# EAGLE design bvsys1 (EAGLE 9.1.0)
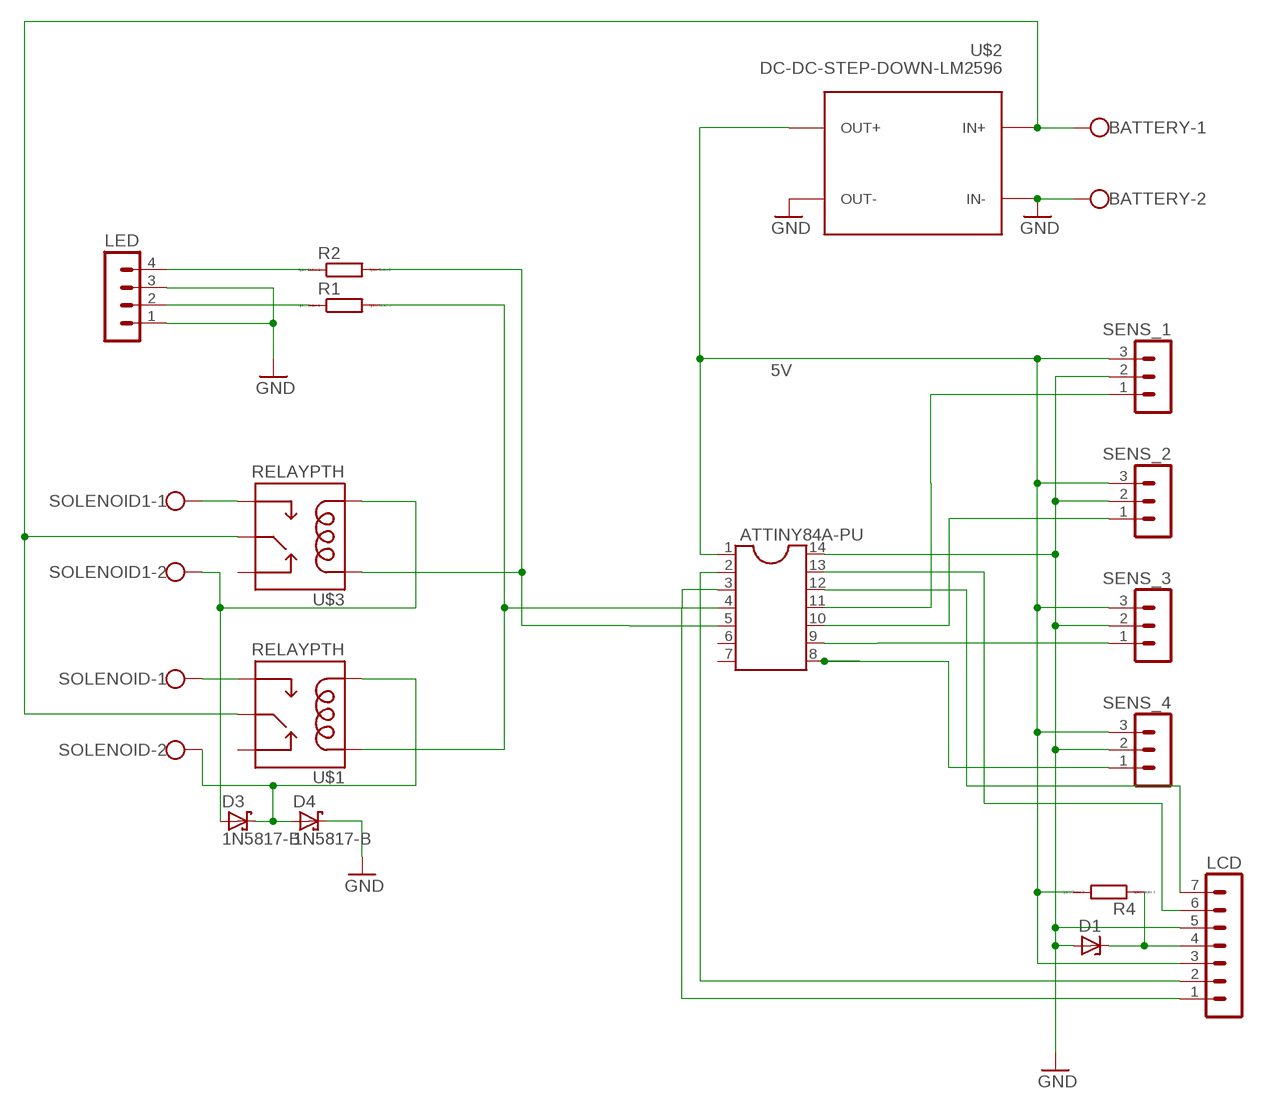
[diagram p0: schematic, sheet 1]

## Parts
ATTINY84A-PU  DIL14S  [SOCKET-14]
BATTERY  W237-102  [W237-102]
D1  ZENER-DIODEDO34-7  [DO34Z7]
D3  1N5817-B  [DO41-7.6]
D4  1N5817-B  [DO41-7.6]
LCD  MA07-1  [MA07-1]
LED  MA04-1  [MA04-1]
R1  R0204/7  [0204/7]
R2  R0204/7  [0204/7]
R4  R0204/7  [0204/7]
SENS_1  MA03-1  [MA03-1]
SENS_2  MA03-1  [MA03-1]
SENS_3  MA03-1  [MA03-1]
SENS_4  MA03-1  [MA03-1]
SOLENOID  W237-102  [W237-102]
SOLENOID1  W237-102  [W237-102]
U$1  RELAYPTH  [SRD-05VDC-SL-C]
U$2  DC-DC-STEP-DOWN-LM2596  [DC-DC-STEP-DOWN-LM2596]
U$3  RELAYPTH  [SRD-05VDC-SL-C]

## Nets
5V: ATTINY84A-PU.1 LCD.3 R4.2 SENS_1.3 SENS_2.3 SENS_3.3 SENS_4.3 U$2.OUT+
GND: ATTINY84A-PU.14 BATTERY.2 D1.A D4.C LCD.5 LED.1 LED.3 SENS_1.2 SENS_2.2 SENS_3.2 SENS_4.2 U$2.IN- U$2.OUT-
N$1: BATTERY.1 U$1.SWCOMMON U$2.IN+ U$3.SWCOMMON
N$3: ATTINY84A-PU.8 SENS_4.1
N$4: ATTINY84A-PU.13 LCD.6
N$5: ATTINY84A-PU.4 R1.2 U$1.COIL1
N$7: LED.2 R1.1
N$8: ATTINY84A-PU.12 LCD.7
N$9: ATTINY84A-PU.9 SENS_3.1
N$10: SOLENOID.1 U$1.SWOPEN
N$11: ATTINY84A-PU.3 LCD.1
N$12: ATTINY84A-PU.2 LCD.2
N$13: LED.4 R2.1
N$14: SOLENOID1.1 U$3.SWOPEN
N$15: ATTINY84A-PU.10 SENS_2.1
N$16: ATTINY84A-PU.11 SENS_1.1
N$17: ATTINY84A-PU.5 R2.2 U$3.COIL1
N$18: D3.A SOLENOID1.2 U$3.COIL0
N$19: D3.C D4.A SOLENOID.2 U$1.COIL0
N$21: D1.C LCD.4 R4.1
Unconnected: ATTINY84A-PU.6 ATTINY84A-PU.7 U$1.SWCLOSED(SWCLOSE) U$3.SWCLOSED(SWCLOSE)

## Library data of the parts
ATTINY84A-PU = ic-package:DIL14: Dual In Line / Socket
BATTERY SOLENOID SOLENOID1 = con-wago-500:W237-102: WAGO SCREW CLAMP; MPN: 237-102; OC_FARNELL: unknown; OC_NEWARK: 70K9898
D1 = diode:ZENER-DIODE: Z-Diode
D3 D4 = diode:1N581*: 1.0A SCHOTTKY BARRIER RECTIFIER Source: http://www.diodes.com/datasheets/ds23001.pdf
LCD = con-lstb:MA07-1: PIN HEADER; OC_FARNELL: unknown; OC_NEWARK: unknown
LED = con-lstb:MA04-1: PIN HEADER; OC_FARNELL: unknown; OC_NEWARK: unknown
R1 R2 R4 = eagle-ltspice:R: RESISTOR, European symbol; SPICEMODEL: NONE; SPICEPREFIX: R
SENS_1-SENS_4 = con-lstb:MA03-1: PIN HEADER; OC_FARNELL: unknown; OC_NEWARK: unknown
U$1 U$3 = SRD-05VDC-SL-C:RELAY: SPDT relay (COM-00101)
U$2 = diy-modules:DC-DC-STEP-DOWN-LM2596: DC/DC Step-Down Regulator based on LM2596-ADJ chip LM2596 datasheet available here: http://www.ti.com/lit/ds/symlink/lm2596.pdf Click here to find device on ebay.com <http://www.ebay.com/sch/lm2596+power+regulator>

## Board
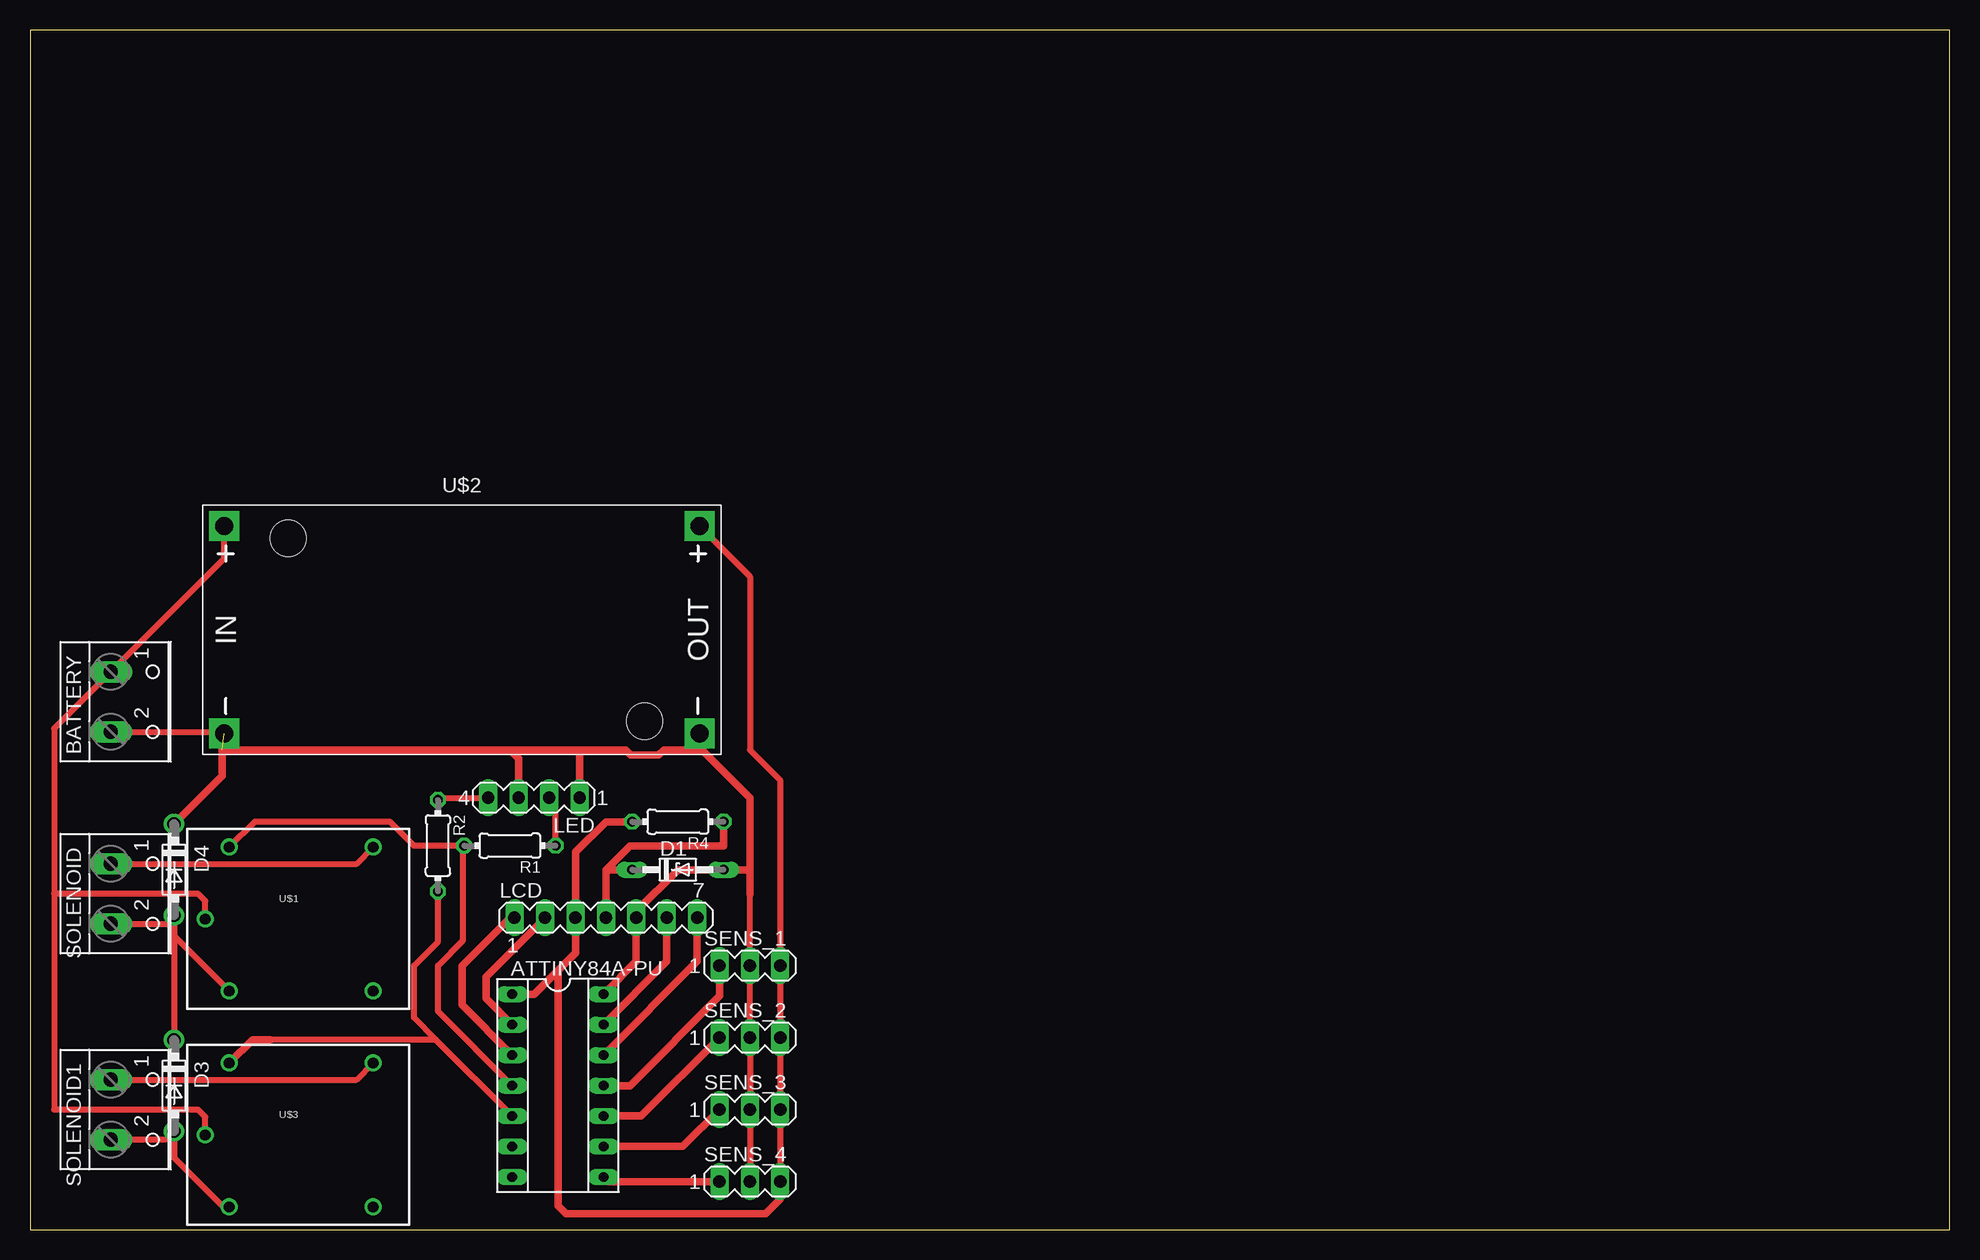
[diagram p1: board, top side]

Size 160 x 100 mm. Coordinates in mm from the lower left corner, seen from the top.
Outline: 0,0 160,0 160,100 0,100 0,0
Copper layers (1*16): Top 0.035mm / dielectric 1.5mm / Bottom 0.035mm
Design rules "default": minimum track width 6mil, minimum drill 0.35mm, track to track 6mil, track to pad 6mil, pad to pad 6mil, via to via 6mil, smd to smd 6mil, copper to edge 40mil, drill to drill 6mil, minimum pad ring 10mil, minimum via ring 8mil, stop-mask expansion 4mil, vias tented up to drill 0mil, thermal gap 10mil

### Footprints (pad centres in the part's own frame; a part is rotated, then mirrored left to right if it is on the bottom)
SOCKET-14 = drill 0.813 long: 1 -7.62,-3.81; 2 -5.08,-3.81; 3 -2.54,-3.81; 4 0,-3.81; 5 2.54,-3.81; 6 5.08,-3.81; 7 7.62,-3.81; 8 7.62,3.81; 9 5.08,3.81; 10 2.54,3.81; 11 0,3.81; 12 -2.54,3.81; 13 -5.08,3.81; 14 -7.62,3.81
W237-102 = drill 1.194 long: 1 -2.5,-1.27; 2 2.5,-1.27
DO34Z7 = drill 0.813 long: A 3.81,0; C -3.81,0
DO41-7.6 = drill 1.1 pad 1.7: A 3.81,0; C -3.81,0
MA07-1 = drill 1.016 long: 1 -7.62,0; 2 -5.08,0; 3 -2.54,0; 4 0,0; 5 2.54,0; 6 5.08,0; 7 7.62,0
MA04-1 = drill 1.016 long: 1 -3.81,0; 2 -1.27,0; 3 1.27,0; 4 3.81,0
0204/7 = drill 0.813 octagon: 1 -3.81,0; 2 3.81,0
MA03-1 = drill 1.016 long: 1 -2.54,0; 2 0,0; 3 2.54,0
SRD-05VDC-SL-C = drill 0.9: COIL0 -5.39,-6.12; COIL1 -5.39,5.88; SWCLOSED 6.61,-6.12; SWCOMMON -7.39,-0.12; SWOPEN 6.61,5.88
DC-DC-STEP-DOWN-LM2596 = drill 1.5 pad 2.5 square: IN+ -19.812,8.636; IN- -19.812,-8.636; OUT+ 19.812,8.636; OUT- 19.812,-8.636 | hole 3: -14.478,7.62; 15.24,-7.62

### Placement (x,y rotation side)
ATTINY84A-PU  44,12 270 top
BATTERY  8,44 270 top
D1  54,30 0 top
D3  12,12 270 top
D4  12,30 270 top
LCD  48,26 0 top
LED  42,36 180 top
R1  40,32 180 top
R2  34,32 270 top
R4  54,34 180 top
SENS_1  60,22 0 top
SENS_2  60,16 0 top
SENS_3  60,10 0 top
SENS_4  60,4 0 top
SOLENOID  8,28 270 top
SOLENOID1  8,10 270 top
U$1  22,26 0 top
U$2  36,50 0 top
U$3  22,8 0 top

### Tracks (layer width: path | path; a pad name or v marks a point on that pad's centre or on a via)
5V
  Top 0.508: 62,4 SENS_4.3 SENS_3.3 SENS_2.3 SENS_1.3 62.54,37.46 60,40 60,54.45 U$2.OUT+
  Top 0.61: SENS_4.3 62.54,2.54 61.32,1.32 44.68,1.32 44,2 44,21.62 | ATTINY84A-PU.1 42,19.62 44,21.62 | 44,21.62 45.46,23.08 LCD.3 | 45.46,26.73 LCD.3 | R4.2 48,34 45.46,31.46 LCD.3
GND  (1 unrouted)
  Top 0.508: SENS_4.2 SENS_3.2 SENS_2.2 SENS_1.2 60,28 | BATTERY.2 16.05,41.5 U$2.IN- | LED.3 40.73,37.27
  Top 0.61: 60,30 60,36 56,40 | 60,30 60,28 | U$2.OUT- 56,41.18 56,40 | ATTINY84A-PU.14 50.54,22.35 LCD.5 | D4.C 16,37.81 16,40 40,40 | 40,40 46,40 | 46,40 49.63,40 50.07,39.56 52.41,39.56 52.85,40 56,40 | LED.3 40.73,39.27 40,40 | LED.1 45.81,39.81 46,40 | LCD.5 50.19,26.35 | 60,30 D1.A 54,30 50.54,26.54 LCD.5
N$1
  Top 0.508: U$2.IN+ 16.19,55.96 BATTERY.1 2,41.77 2,28 | 2,28 14,28 14.61,27.39 U$1.SWCOMMON | 2,28 2,10 14,10 14.61,9.39 U$3.SWCOMMON
N$3
  Top 0.61: SENS_4.1 48.19,4 ATTINY84A-PU.8
N$4
  Top 0.61: ATTINY84A-PU.13 53.08,22.35 LCD.6
N$5
  Top 0.508: U$1.COIL1 18.73,34 30,34 32,32 R1.2 36.09,32.09 36.09,24.09 34,22 34,18.19 ATTINY84A-PU.4
N$7
  Top 0.508: R1.1 43.81,35.46 LED.2
N$8
  Top 0.61: ATTINY84A-PU.12 55.62,22.35 LCD.7
N$9
  Top 0.61: SENS_3.1 54.38,6.92 ATTINY84A-PU.9
N$10
  Top 0.508: SOLENOID.1 27.23,30.5 U$1.SWOPEN
N$11
  Top 0.61: ATTINY84A-PU.3 36,18.73 36,22 40,26 LCD.1
N$12
  Top 0.61: ATTINY84A-PU.2 38,19.27 38,20 38,21.08 LCD.2
N$13
  Top 0.508: R2.1 34.19,36 LED.4
N$14
  Top 0.508: SOLENOID1.1 27.23,12.5 U$3.SWOPEN
N$15
  Top 0.61: SENS_2.1 50.92,9.46 ATTINY84A-PU.10
N$16
  Top 0.61: SENS_1.1 57.46,19.46 50,12 ATTINY84A-PU.11
N$17
  Top 0.508: ATTINY84A-PU.5 33.83,15.82 | 33.83,15.82 20,15.82 18.55,15.82 | R2.2 33.91,28.09 34,28 34,24 32,22 32,17.65 33.83,15.82
  Top 0.61: U$3.COIL1 18.55,15.82 20,15.82
N$18
  Top 0.508: SOLENOID1.2 11.31,7.5 D3.A 12,6 16.12,1.88 U$3.COIL0
N$19
  Top 0.508: D4.A 12,25.5 | 12,24.49 U$1.COIL0 | SOLENOID.2 12,25.5 | 12,24.49 D3.C | 12,25.5 12,24.49
N$21
  Top 0.61: R4.1 57.81,32 50,32 48,30 | LCD.4 48,30 | D1.C 48,30